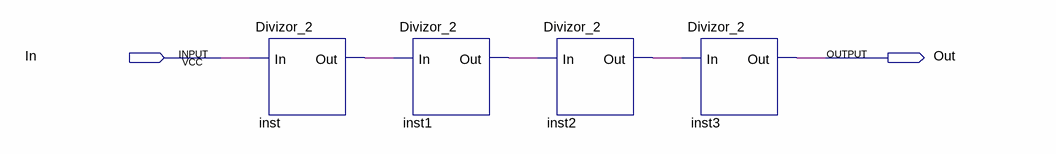
[diagram p0: schematic sheet]
// Quartus schematic Div_16.bdf as structural Verilog: 4 symbols, 2 pins
module Div_16 (
  input  In,
  output Out
);

  wire inst1_out, inst2_out, inst_out;

  Divizor_2 inst (.In(In), .Out(inst_out));
  Divizor_2 inst1 (.In(inst_out), .Out(inst1_out));
  Divizor_2 inst2 (.In(inst1_out), .Out(inst2_out));
  Divizor_2 inst3 (.In(inst2_out), .Out(Out));
endmodule
